# EAGLE design Energy Meter for Home Assistant V1.1 (EAGLE 6.1)
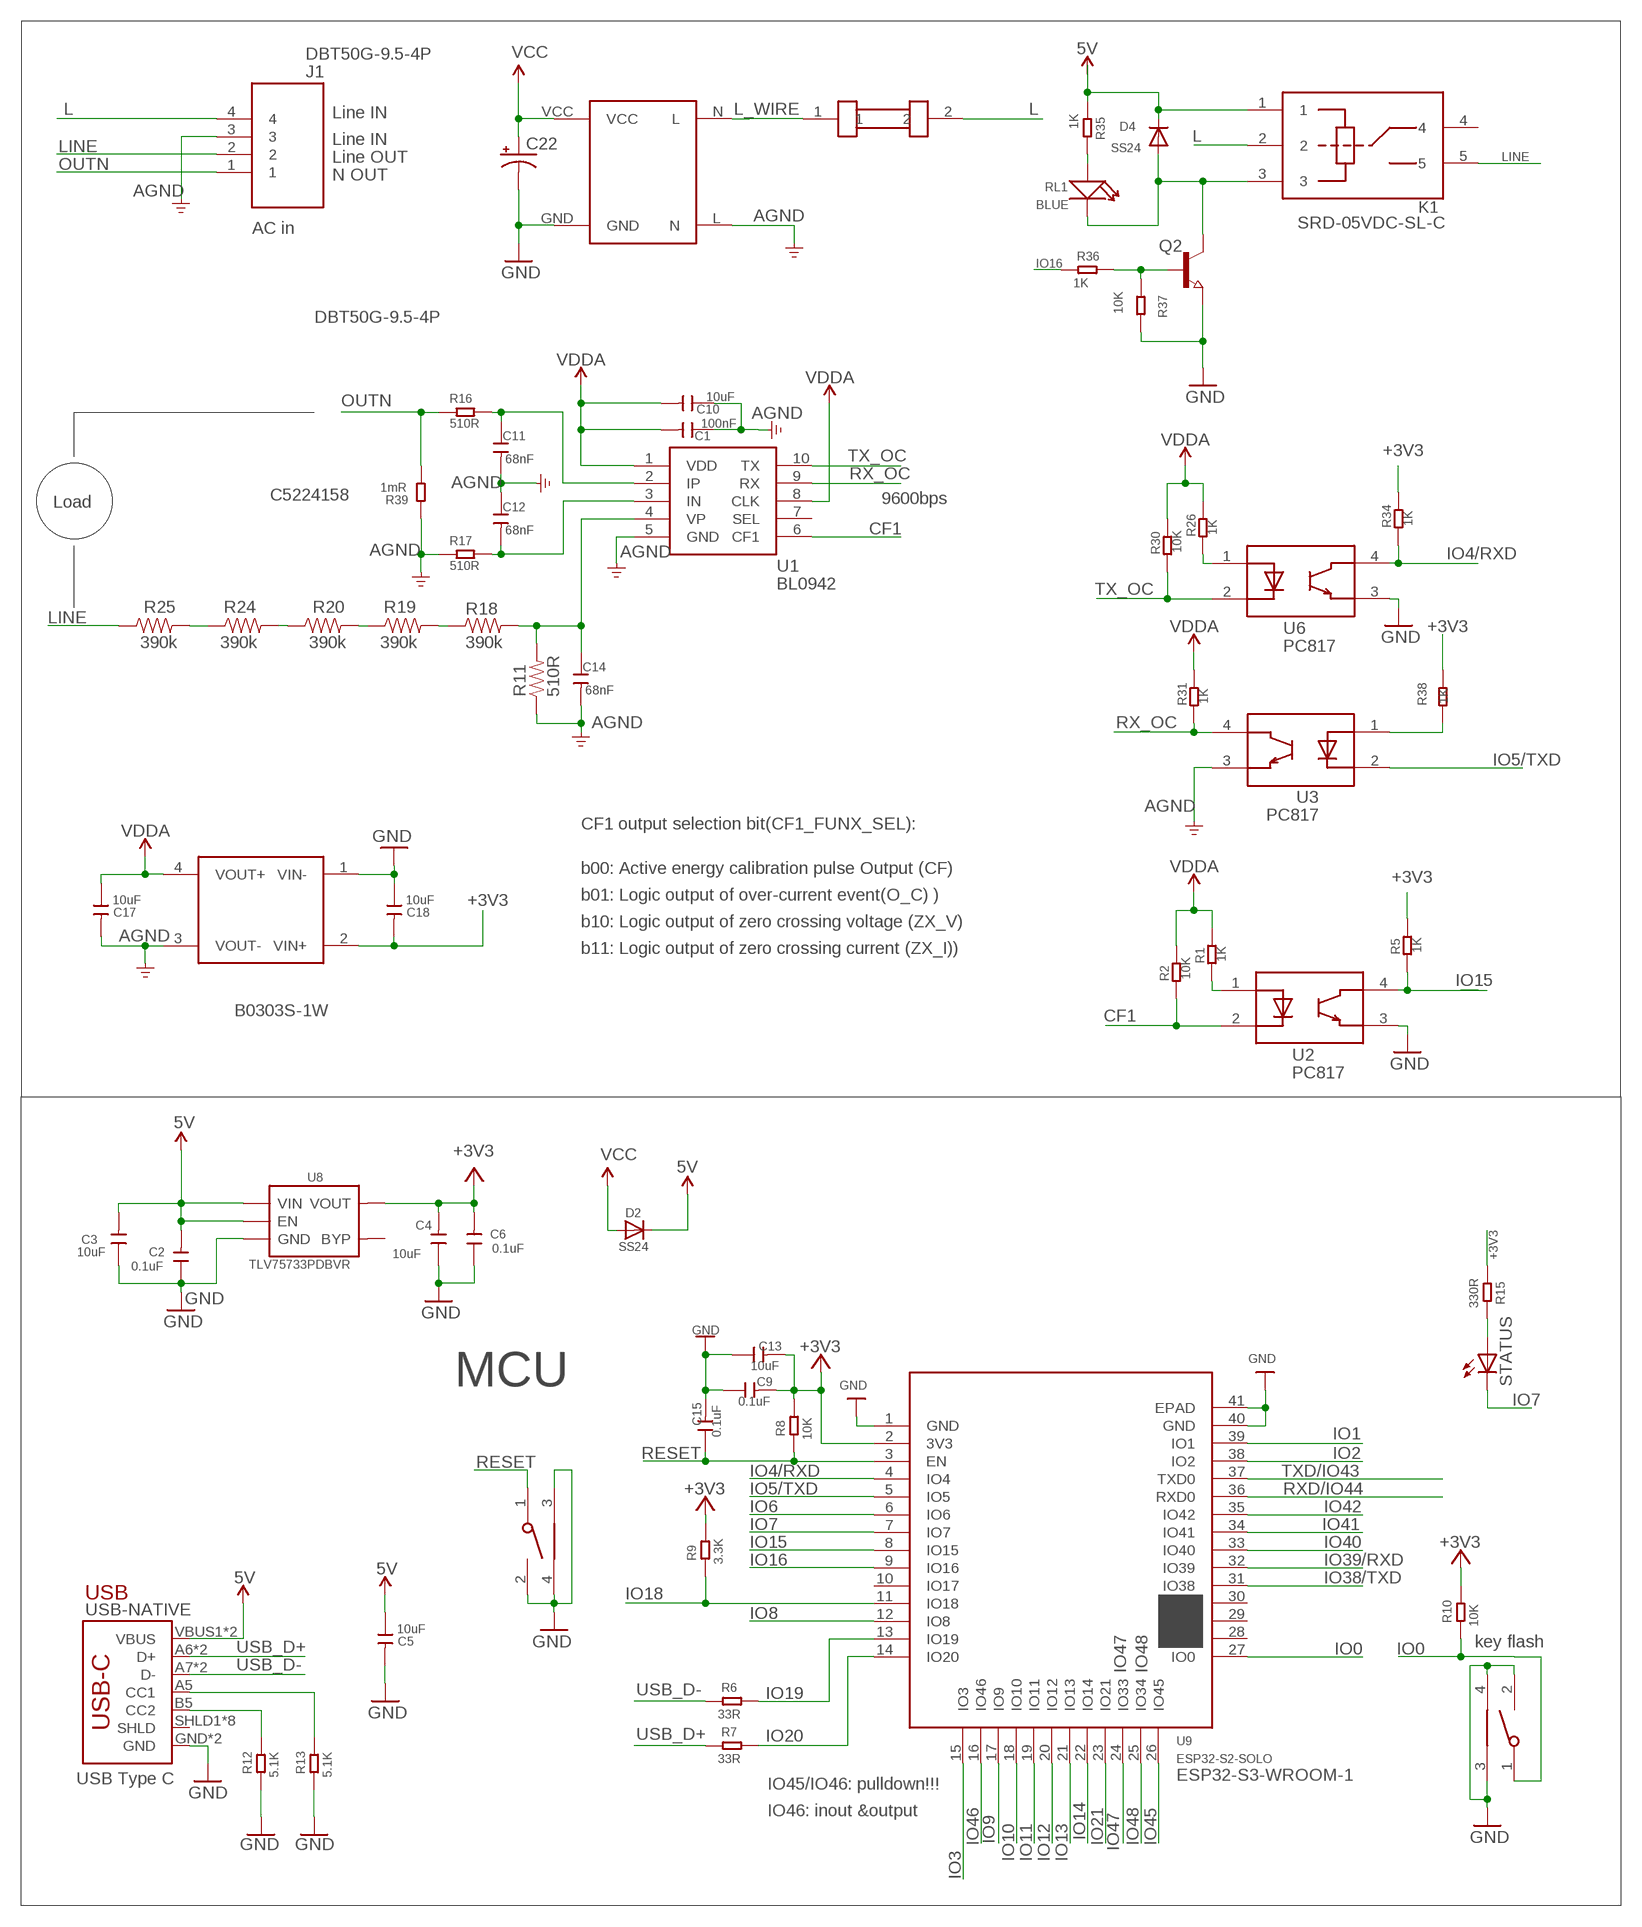
[diagram p0: schematic, sheet 1]

## Parts
BOOT  TS24CA  [2*4*3.5MM]
C1  100nF  C-0603  [0603]
C2  0.1uF  C-0603  [0603]
C3  10uF  C-0603  [0603]
C4  10uF  C-0603  [0603]
C5  10uF  C-0603  [0603]
C6  0.1uF  C-0603  [0603]
C9  0.1uF  C-0603  [0603]
C10  10uF  C-0603  [0603]
C11  68nF  C-0603  [0603]
C12  68nF  C-0603  [0603]
C13  10uF  C-0603  [0603]
C14  68nF  C-0603  [0603]
C15  0.1uF  C-0603  [0603]
C17  10uF  C-0603  [0603]
C18  10uF  C-0603  [0603]
C22  CAP_POL3528-KIT  [EIA3528-KIT]
D2  SS24  DIODESMA  [SMADIODE]
D4  SS24  DIODESMA  [SMADIODE]
F1  FUSE01  [FUSE01-D4XL11]
J1  DBT50G-9.5-4P  [DBT50G-9.5-4P]
K1  JQC3FF  [DIP5_JQC3FF]
Q2  NPN-TRANSISTOR_SOT23  [SOT23]
R1  1K  R-0603  [R0603]
R2  10K  R-0603  [R0603]
R5  1K  R-0603  [R0603]
R6  33R  R-0603  [R0603]
R7  33R  R-0603  [R0603]
R8  10K  R-0603  [R0603]
R9  3.3K  R-0603  [R0603]
R10  10K  R-0603  [R0603]
R11  510R  RESISTOR1206  [1206]
R12  5.1K  R-0603  [R0603]
R13  5.1K  R-0603  [R0603]
R15  330R  R-0603  [R0603]
R16  510R  R-0603  [R0603]
R17  510R  R-0603  [R0603]
R18  390k  RESISTOR1206  [1206]
R19  390k  RESISTOR1206  [1206]
R20  390k  RESISTOR1206  [1206]
R24  390k  RESISTOR1206  [1206]
R25  390k  RESISTOR1206  [1206]
R26  1K  R-0603  [R0603]
R30  10K  R-0603  [R0603]
R31  1K  R-0603  [R0603]
R34  1K  R-0603  [R0603]
R35  1K  R-0603  [R0603]
R36  1K  R-0603  [R0603]
R37  10K  R-0603  [R0603]
R38  1K  R-0603  [R0603]
R39  1mR  DISCRETE_R-2512  [DISCRETE_R2512]
RL1  BLUE  LED'0603'  [LED-0603]
RST  TS24CA  [2*4*3.5MM]
STATUS  LED5MM  [LED5MM]
U1  BL0942  BL0942*SOP*  [SOP8-100P-600L500W175H]
U2  PC817  [SMD4-254P-1016L460W]
U3  PC817  [SMD4-254P-1016L460W]
U5  AC-DCHLK01  [HLK-PM01]
U6  PC817  [SMD4-254P-1016L460W]
U7  B0303S  [B0303S]
U8  TLV75733PDBVR  SPX3819  [SOT23-5]
U9  ESP32­S2­SOLO  [ESP32-­S2-­SOLO]
USB-NATIVE  USB_C5  [USB-C-16P-5]

## Nets
5V: C2.2 C3.2 C5.1 D2.C D4.C K1.1 R35.1 U8.1(VIN) U8.3(EN) USB-NATIVE.VBUS1(VBUS) USB-NATIVE.VBUS2(VBUS)
+3V3: C4.2 C6.2 C9.2 C13.2 C18.2 R5.2 R8.2 R9.2 R10.2 R15.1 R34.2 R38.2 U7.2(VIN+) U8.5(VOUT) U9.2(3V3)
AGND: C1.1 C10.1 C11.2 C12.1 C14.2 C17.2 J1.3 R11.1 R17.2 R39.1 U1.5(GND) U3.3 U5.L(N) U7.3(VOUT-)
CF1: R2.1 U1.6(CF1) U2.2
GND: BOOT.2 BOOT.3 BOOT.4 C2.1 C3.1 C4.1 C5.2 C6.1 C9.1 C13.1 C15.2 C18.1 C22.C(-) Q2.2(E) R12.1 R13.1 R37.2 RST.2 RST.3 RST.4 U2.3 U5.GND U6.3 U7.1(VIN-) U8.2(GND) U9.1(GND) U9.40(GND) U9.41(EPAD) USB-NATIVE.GND USB-NATIVE.GND2(GND)
IO0: BOOT.1 R10.1 U9.27(IO0)
IO1: U9.39(IO1)
IO2: U9.38(IO2)
IO3: U9.15(IO3)
IO4/RXD: R34.1 U6.4 U9.4(IO4)
IO5/TXD: U3.2 U9.5(IO5)
IO6: U9.6(IO6)
IO7: STATUS.K(C) U9.7(IO7)
IO8: U9.12(IO8)
IO9: U9.17(IO9)
IO10: U9.18(IO10)
IO11: U9.19(IO11)
IO12: U9.20(IO12)
IO13: U9.21(IO13)
IO14: U9.22(IO14)
IO15: R5.1 U2.4 U9.8(IO15)
IO16: R36.1 U9.9(IO16)
IO18: R9.1 U9.11(IO18)
IO19: R6.2 U9.13(IO19)
IO20: R7.2 U9.14(IO20)
IO21: U9.23(IO21)
IO38/TXD: U9.31(IO38)
IO39/RXD: U9.32(IO39)
IO40: U9.33(IO40)
IO41: U9.34(IO41)
IO42: U9.35(IO42)
IO45: U9.26(IO45)
IO46: U9.16(IO46)
IO47: U9.24(IO33)
IO48: U9.25(IO34)
L: F1.2 J1.4 K1.2
L_WIRE: F1.1 U5.N(L)
LINE: J1.2 K1.5 R25.1
N$1: R1.1 U2.1
N$5: R15.2 STATUS.A
N$6: R13.2 USB-NATIVE.A5(CC1)
N$8: R38.1 U3.1
N$10: C11.1 R16.1 U1.2(IP)
N$11: C12.2 R17.1 U1.3(IN)
N$13: R26.1 U6.1
N$14: R12.2 USB-NATIVE.B5(CC2)
N$22: C14.1 R11.2 R18.2 U1.4(VP)
N$23: R20.1 R24.2
N$25: R24.1 R25.2
N$26: R35.2 RL1.+
N$27: D4.A K1.3 Q2.3(C) RL1.-
N$28: Q2.1(B) R36.2 R37.1
N$29: R19.1 R20.2
N$30: R18.1 R19.2
OUTN: J1.1 R16.2 R39.2
RESET: C15.1 R8.1 RST.1 U9.3(EN)
RX_OC: R31.1 U1.9(RX) U3.4
RXD/IO44: U9.36(RXD0)
TX_OC: R30.1 U1.10(TX) U6.2
TXD/IO43: U9.37(TXD0)
USB_D+: R7.1 USB-NATIVE.A6(D+) USB-NATIVE.B6(D+)
USB_D-: R6.1 USB-NATIVE.A7(D-) USB-NATIVE.B7(D-)
VCC: C22.A(+) D2.A U5.VCC
VDDA: C1.2 C10.2 C17.1 R1.2 R2.2 R26.2 R30.2 R31.2 U1.1(VDD) U1.8(CLK) U7.4(VOUT+)
Unconnected: K1.4 U1.7(SEL) U8.4(BYP) U9.10(IO17) U9.28(IO35) U9.29(IO36) U9.30(IO37) USB-NATIVE.SHLD1(SHLD) USB-NATIVE.SHLD2(SHLD) USB-NATIVE.SHLD3(SHLD) USB-NATIVE.SHLD4(SHLD) USB-NATIVE.SHLD5(SHLD) USB-NATIVE.SHLD6(SHLD) USB-NATIVE.SHLD7(SHLD) USB-NATIVE.SHLD8(SHLD)

## Notes on the sheet
- Line IN
- Line IN
- Line OUT
- N OUT
- SRD-05VDC-SL-C
- AC in
- DBT50G-9.5-4P
- C5224158 | 9600bps
- Load
- CF1 output selection bit(CF1_FUNX_SEL):
- b00: Active energy calibration pulse Output (CF)
- b01: Logic output of over-current event(O_C) )
- b10: Logic output of zero crossing voltage (ZX_V)
- b11: Logic output of zero crossing current (ZX_I))
- B0303S-1W
- MCU
- USB
- key flash
- IO47 | IO48
- USB Type C | ESP32-S3-WROOM-1
- IO45/IO46: pulldown!!!
- IO46: inout &output

## Library data of the parts
BOOT RST = sale:TS24CA
C1-C6 C9-C15 C17 C18 = Discrete:C*: Ceramic Capacitors
C22 = SparkFun-Capacitors:CAP_POL: Capacitor Polarized These are standard SMD and PTH capacitors. Normally 10uF, 47uF, and 100uF in electrolytic and tantalum varieties. Always verify the external diameter of the through hole cap, it varies with capacity, voltage, and manufacturer. The EIA devices should be standard.
D2 D4 = adafruit:DIODE: Diode SMADIODE - SMA Surface Mount Package 20V 1A Schottky Diode Digikey: 641-1014-6-ND DO-1N4148 - Through Hole Small Current Diode SOD-123 20V 1 A (.5mV Vf) Schottky Diode - Digikey: MBRX120TPMSCT-ND SOD-323 10V 570mA (.38mV Vf, 3ns) Schottky Diode - Digikey: ZLLS410CT-ND SOD-523 30V 30mA Schottky Diode (RB751S-40TE61) - Digikey: RB751S-40TE61CT-ND SOT23-R/W - SOT23 Package (R = Solder Paste/Reflow Ovens, W = Hand-Soldering) BAT54Film 40V 300mA - Digikey: 497-7162-1-ND
F1 = user:FUSE01
J1 = user:DBT50G-9.5-4P
K1 = 1mytest:JQC3FF
Q2 = semicon-smd-ipc:NPN-TRANSISTOR_: NPN TRANSISTOR
R1 R2 R5-R10 R12 R13 R15-R17 R26 R30 R31 R34-R38 = Discrete:R*
R11 R18-R20 R24 R25 = SparkFun-Resistors:RESISTOR: Resistor Basic schematic elements and footprints for 0603, 1206, and PTH resistors.; K: 45K
R39 = A9G:DISCRETE_R*
RL1 = Discrete:LED*
STATUS = led:LED: LED OSRAM: - CHIPLED LG R971, LG N971, LY N971, LG Q971, LY Q971, LO R971, LY R971 LH N974, LH R974 LS Q976, LO Q976, LY Q976 LO Q996 - Hyper CHIPLED LW Q18S LB Q993, LB Q99A, LB R99A - SideLED LS A670, LO A670, LY A670, LG A670, LP A670 LB A673, LV A673, LT A673, LW A673 LH A674 LY A675 LS A676, LA A676, LO A676, LY A676, LW A676 LS A679, LY A679, LG A679 - Hyper Micro SIDELED® LS Y876, LA Y876, LO Y876, LY Y876 LT Y87S - SmartLED LW L88C, LW L88S LB L89C, LB L89S, LG L890 LS L89K, LO L89K, LY L89K LS L896, LA L896, LO L896, LY L896 - TOPLED LS T670, LO T670, LY T670, LG T670, LP T670 LSG T670, LSP T670, LSY T670, LOP T670, LYG T670 LG T671, LOG T671, LSG T671 LB T673, LV T673, LT T673, LW T673 LH T674 LS T676, LA T676, LO T676, LY T676, LB T676, LH T676, LSB T676, LW T676 LB T67C, LV T67C, LT T67C, LS T67K, LO T67K, LY T67K, LW E67C LS E67B, LA E67B, LO E67B, LY E67B, LB E67C, LV E67C, LT E67C LW T67C LS T679, LY T679, LG T679 LS T770, LO T770, LY T770, LG T770, LP T770 LB T773, LV T773, LT T773, LW T773 LH T774 LS E675, LA E675, LY E675, LS T675 LS T776, LA T776, LO T776, LY T776, LB T776 LHGB T686 LT T68C, LB T68C - Hyper Mini TOPLED® LB M676 - Mini TOPLED Santana® LG M470 LS M47K, LO M47K, LY M47K Source: http://www.osram.convergy.de LUXEON: - LUMILED® LXK2-PW12-R00, LXK2-PW12-S00, LXK2-PW14-U00, LXK2-PW14-V00 LXK2-PM12-R00, LXK2-PM12-S00, LXK2-PM14-U00 LXK2-PE12-Q00, LXK2-PE12-R00, LXK2-PE12-S00, LXK2-PE14-T00, LXK2-PE14-U00 LXK2-PB12-K00, LXK2-PB12-L00, LXK2-PB12-M00, LXK2-PB14-N00, LXK2-PB14-P00, LXK2-PB14-Q00 LXK2-PR12-L00, LXK2-PR12-M00, LXK2-PR14-Q00, LXK2-PR14-R00 LXK2-PD12-Q00, LXK2-PD12-R00, LXK2-PD12-S00 LXK2-PH12-R00, LXK2-PH12-S00 LXK2-PL12-P00, LXK2-PL12-Q00, LXK2-PL12-R00 Source: www.luxeon.com KINGBRIGHT: KA-3528ASYC Source: www.kingbright.com
U1 = user:BL0942
U2 U3 U6 = self:PC817
U5 = Moja Knjižnica:AC-DCHLK01
U7 = user:B0303S
U8 = IC:SPX3819
U9 = self:ESP32­S2­SOLO
USB-NATIVE = USBC:USB_C: USB Type C 16Pin Connector Super Speed pins not available on the 16-pin purely SMD connector so this part is best for USB 2.0 implementations. D1 and D2 are tied together enabling D+/- no matter which way the cable is plugged into the connector. The two channel configuration pins (CC1/2) are exposed. These are normally connected to ground via 5.1k resistors but can be reconfigured for high current/high power applications.

## Net classes
0 default: width 0.203 mm, drill 0.305 mm, clearance 0.152 mm
1 AC High Current: width 2.54 mm, drill 25.4 mm, clearance 1.27 mm
2 gnd: width 0.305 mm, drill 0.559 mm, clearance 0.254 mm
3 usbvcc: width 0.508 mm, drill 0.61 mm, clearance 0.254 mm

## Board
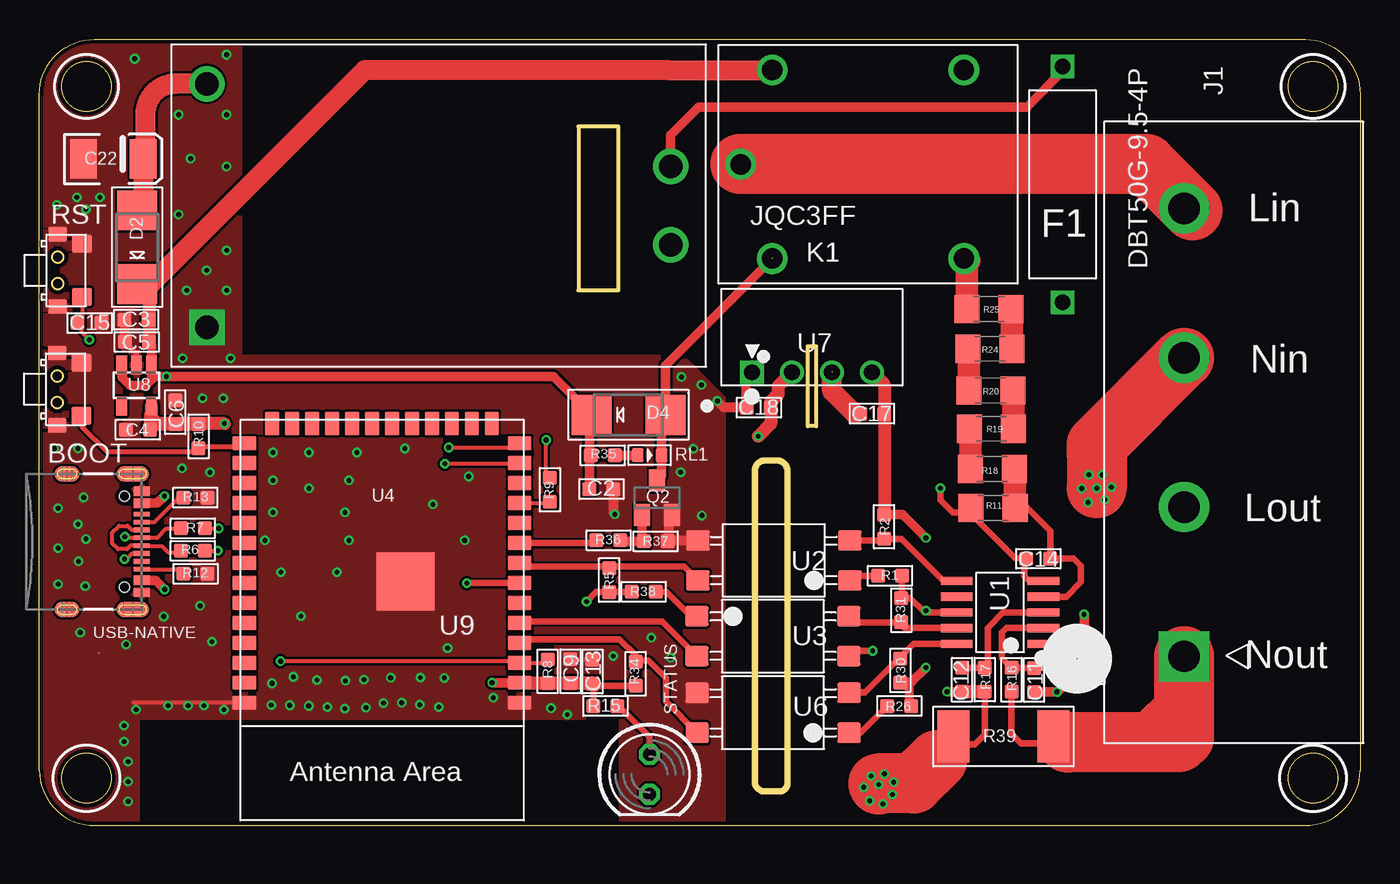
[diagram p1: board, top side]
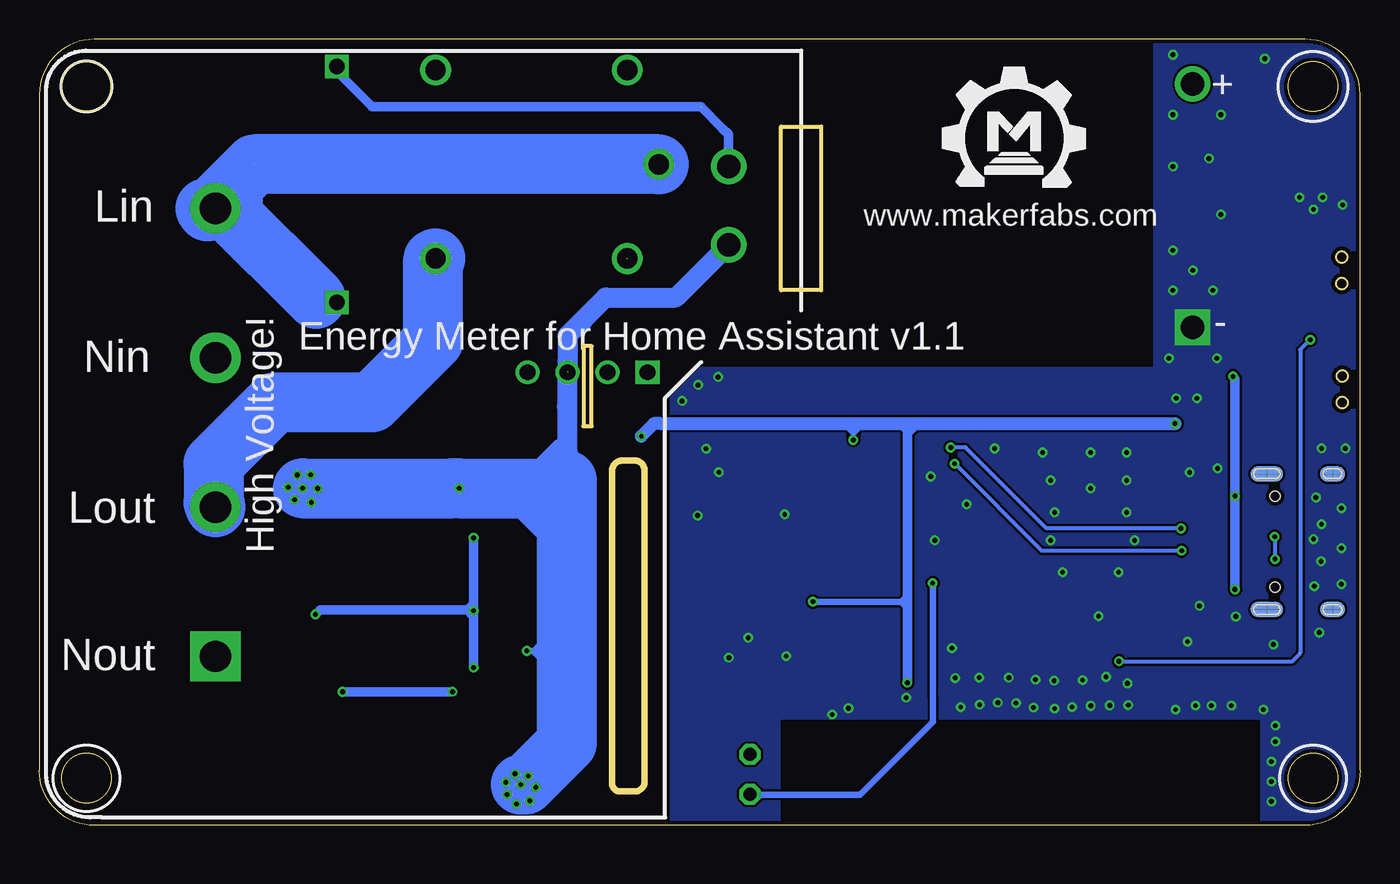
[diagram p2: board, bottom side, seen from below]

Size 84 x 50 mm. Coordinates in mm from the lower left corner, seen from the top.
Outline: 0,3.5 0,46.5 arc-90 3.5,50 80.5,50 arc-90 84,46.5 84,3.5 arc-90 80.5,0 3.5,0 arc-90 0,3.5
Outline: 45.52,22.57 45.52,2.75 arc90 46.11,2.16 47.07,2.16 arc90 47.57,2.66 47.57,22.53 arc90 46.89,23.22 46.16,23.22 arc90 45.52,22.57
Outline: 34.29,44.45 34.29,34.04 36.83,34.04 36.83,44.45 34.29,44.45
Outline: 48.87,30.48 49.4,30.48 49.4,25.4 48.87,25.4 48.87,30.48
Outline: circle at 81,3 radius 1.57
Outline: circle at 81,47 radius 1.57
Outline: circle at 3,3 radius 1.57
Outline: circle at 3,47 radius 1.57
Copper layers (1*16): Top 0.035mm / dielectric 1.5mm / Bottom 0.035mm
Design rules: minimum track width 6mil, minimum drill 12mil, track to track 6mil, track to pad 6mil, pad to pad 6mil, via to via 6mil, smd to smd 0mil, copper to edge 10mil, drill to drill 10mil, minimum pad ring 10mil, minimum via ring 6mil, stop-mask expansion 2mil, vias tented up to drill 100mil, thermal gap 0mil
tRestrict: area 6.4,0 to 36.8,6.7
bRestrict: area 6.4,0 to 36.8,6.7

### Footprints (pad centres in the part's own frame; a part is rotated, then mirrored left to right if it is on the bottom)
2*4*3.5MM = smd 1.15 x 1.3: 1 -1.675,0; 2 1.675,0 | smd 0.9 x 1.2: 3 2.3,1.55; 4 -2.3,1.55
0603 = smd 0.889 x 0.889: 1 -0.762,0; 2 0.762,0
EIA3528-KIT = smd 1.7 x 2.5: A 1.9,0; C -1.9,0
SMADIODE = smd 2.54 x 2.54: A 2.349,0; C -2.349,0
FUSE01-D4XL11 = drill 1 square: 1 -7.5,0; 2 7.5,0
DBT50G-9.5-4P = drill 2 pad 3.2 square: 1 -14.25,0 | drill 2 pad 3.2: 2 -4.75,0; 3 4.75,0; 4 14.25,0
DIP5_JQC3FF = drill 1.3: 1 0,12; 2 -2,6; 3 0,0; 4 12.2,12; 5 12.2,0
SOT23 = smd 1 x 1.4: 1 -0.95,-1.1; 2 0.95,-1.1; 3 0,1.1
R0603 = smd 0.889 x 0.889: 1 -0.762,0; 2 0.762,0
1206 = smd 1.6 x 1.8: 1 -1.4,0; 2 1.4,0
DISCRETE_R2512 = smd 2.032 x 3.302: 1 -3.175,0; 2 3.175,0
LED-0603 = smd 0.762 x 0.889: + -0.762,0; - 0.762,0
LED5MM = drill 0.813 octagon: A -1.27,0; K 1.27,0
SOP8-100P-600L500W175H = smd 0.525 x 2.014: 1 -2,-2.757; 2 -1,-2.757; 3 0,-2.757; 4 1,-2.757; 5 2,-2.757; 6 2,2.757; 7 1,2.757; 8 0,2.757; 9 -1,2.757; 10 -2,2.757
SMD4-254P-1016L460W = smd 1.5 x 1.3: 1 -4.83,1.27; 2 -4.83,-1.27; 3 4.83,-1.27; 4 4.83,1.27
HLK-PM01 = drill 1.5 square: GND 14.75,7.75 | drill 1.5: L -14.75,2.5; N -14.75,-2.5; VCC 14.75,-7.75
B0303S = drill 1 square: 1 -3.81,0 | drill 1: 2 -1.27,0; 3 1.27,0; 4 3.81,0
SOT23-5 = smd 0.69 x 1.2: 1 -0.95,-1.3; 2 0,-1.3; 3 0.95,-1.3; 4 0.95,1.3; 5 -0.95,1.3
ESP32-­S2-­SOLO = smd 1.5 x 0.9: 1 -8.75,5.26; 2 -8.75,3.99; 3 -8.75,2.72; 4 -8.75,1.45; 5 -8.75,0.18; 6 -8.75,-1.09; 7 -8.75,-2.36; 8 -8.75,-3.63; 9 -8.75,-4.9; 10 -8.75,-6.17; 11 -8.75,-7.44; 12 -8.75,-8.71; 13 -8.75,-9.98; 14 -8.75,-11.25; 27 8.75,-11.25; 28 8.75,-9.98; 29 8.75,-8.71; 30 8.75,-7.44; 31 8.75,-6.17; 32 8.75,-4.9; 33 8.75,-3.63; 34 8.75,-2.36; 35 8.75,-1.09; 36 8.75,0.18; 37 8.75,1.45; 38 8.75,2.72; 39 8.75,3.99; 40 8.75,5.26 | smd 0.9 x 1.5: 15 -6.985,-12.5; 16 -5.715,-12.5; 17 -4.445,-12.5; 18 -3.175,-12.5; 19 -1.905,-12.5; 20 -0.635,-12.5; 21 0.635,-12.5; 22 1.905,-12.5; 23 3.175,-12.5; 24 4.445,-12.5; 25 5.715,-12.5; 26 6.985,-12.5 | smd 3.7 x 3.7: 41 -1.5,-2.46
USB-C-16P-5 = smd 0.3 x 1: A5 -1.25,-0.34; A6 -0.25,-0.34; A7 0.25,-0.34; A8 1.25,-0.34; B5 1.75,-0.34; B6 0.75,-0.34; B7 -0.75,-0.34; B8 -1.75,-0.34 | smd 0.6 x 1: GND -3.225,-0.34; GND2 3.225,-0.34; VBUS1 -2.45,-0.34; VBUS2 2.45,-0.34 | smd 1 x 2.1: SHLD1 -4.32,-0.915; SHLD2 4.32,-0.915 | smd 1 x 2.1 bottom: SHLD3 -4.32,-0.915; SHLD4 4.32,-0.915 | smd 1 x 1.6: SHLD5 -4.32,-5.095; SHLD8 4.32,-5.095 | smd 1 x 1.6 bottom: SHLD6 -4.32,-5.095; SHLD7 4.32,-5.095 | hole 0.65: -2.89,-1.445; 2.89,-1.445

### Placement (x,y rotation side)
BOOT  2.68,27.74 90 top
C1  67.08,10.37 90 top
C2  35.74,21.39 180 top
C3  6.16,32.16 0 top
C4  6.27,25.18 0 top
C5  6.19,30.74 180 top
C6  8.65,26.29 270 top
C9  33.77,9.8 270 top
C10  65.63,10.36 90 top
C11  63.26,9.25 270 top
C12  58.68,9.26 90 top
C13  35.18,9.79 270 top
C14  63.53,16.96 180 top
C15  3.2,31.96 0 top
C17  52.95,26.18 180 top
C18  45.76,26.57 0 top
C22  4.71,42.4 0 top
D2  6.23,36.77 90 top
D4  37.46,26.11 0 top
F1  65.07,40.77 270 top
J1  72.8,25 90 top
K1  46.6,36.05 0 top
Q2  39.28,20.84 0 top
R1  54.11,15.87 0 top
R2  53.73,19 90 top
R5  36.23,15.6 270 top
R6  9.76,17.47 0 top
R7  9.77,18.89 0 top
R8  32.32,9.8 270 top
R9  32.47,21.35 90 top
R10  10.12,24.74 90 top
R11  60.65,20.19 0 top
R12  9.94,16 180 top
R13  9.92,20.85 180 top
R15  36,7.59 0 top
R16  61.82,9.26 270 top
R17  60.12,9.27 270 top
R18  60.6,22.67 0 top
R19  60.54,25.23 180 top
R20  60.51,27.66 0 top
R24  60.46,30.31 180 top
R25  60.4,32.84 0 top
R26  54.68,7.6 0 top
R30  54.76,9.86 270 top
R31  54.82,13.68 90 top
R34  37.92,9.65 270 top
R35  35.83,23.53 0 top
R36  36.2,18.13 0 top
R37  39.19,18.07 0 top
R38  38.44,14.85 180 top
R39  61.3,5.65 0 top
RL1  38.82,23.54 0 top
RST  2.71,35.3 90 top
STATUS  38.8,3.24 270 top
U1  61.09,13.55 90 top
U2  46.71,16.85 180 top
U3  46.65,12.03 0 top
U5  25.4,39.42 180 top
U6  46.66,7.16 180 top
U7  49.14,28.81 0 top
U8  6.18,27.98 180 top
U9  21.8,13.06 180 top
U$1  [MAKERFABS_0.3]  26.12,40.63 0 bottom
USB-NATIVE  6.85,18.04 270 top

### Tracks (layer width: path | path; a pad name or v marks a point on that pad's centre or on a via)
5V  (via drill 0.3)
  Top 0.254: 6.97,30.73 6.97,30.74 arc90 6.96,30.76 C5.1 arc-90 C5.1
  Top 0.406: D4.C 34.53,26.7 34.47,26.7 34.47,26.67 34.47,26.75 34.47,26.44 34.42,26.49 34.42,26.67 34.39,26.67 34.37,26.7 34.42,26.7 34.49,26.62 34.48,26.64
  Top 0.61: USB-NATIVE.VBUS2 7.39,15.59 v7.97,15.01 | v7.96,20.95 7.51,20.49 6.45,20.49 | 6.45,20.49 | 6.45,20.49 USB-NATIVE.VBUS1 | 6.97,30.73 7.14,30.56 7.14,29.11 | 7.14,29.11 7.14,28.76 | 7.14,28.76 7.14,28.37 6.76,27.99 5.77,27.99 5.27,28.49 5.27,29.24 U8.3 | 7.14,29.11 U8.1 | C5.1 6.96,32.13 C3.2 | 7.14,28.76 7.35,28.55 v8.08,28.55 30.48,28.55 32.7,28.55 35.06,26.19 35.06,26.16 D4.C 35.02,26.21 34.96,26.21 34.98,26.19 C2.2 34.98,23.54 R35.1
  Top 0.813: D2.C 6.65,33.99 6.97,33.67 6.97,30.73
  Top 1.27: 6.65,33.99 20.7,48.04 39.96,48.04 K1.1 arc-90 46.61,48.03 K1.1 arc90 K1.1 | 6.65,33.99 6.56,33.91 6.65,33.99
  Bottom 0.61: v7.97,15.01 v7.97,20.94 v7.96,20.95 7.96,28.43 v8.08,28.55
+3V3  (via drill 0.3)
  Top 0.254: R9.2 32.23,22.36 v32.23,24.51
  Top 0.406: R38.2 36.25,14.86 R5.2 35.41,14.84 v34.8,14.22 | R34.2 34.88,8.88 34.69,9.07 | 35.12,9.07 35.13,9.07 | 35.13,9.07 C13.2 35.24,8.97 R15.1 | 35.13,9.07 35.12,9.07 | 35.12,9.07 32.36,9.07 R8.2 | C6.2 8.62,25.5 7.62,25.5 | 7.11,26.42 6.86,26.16 6.86,25.15 7,25.15 C4.2
  Top 0.61: 35.12,9.07 v28.8,9.07
  Top 0.813: 35.21,9.02 35.21,9.01 35.19,9.01 35.12,9.07 34.69,9.07 U9.2 30.58,9.04 C9.2 | v11.77,25.55 7.52,25.55 | 7.52,25.55 7.14,25.94 U8.5 | R10.2 7.62,25.5 7.58,25.5 | 7.58,25.5 7.52,25.55 | 7.58,25.5 7.36,25.5 C4.2 | U7.2 46.99,27.93 46.99,27.43 46.52,26.96 C18.2 46.52,25.55 v45.72,24.75
  Bottom 0.254: 32.44,25.55 32.23,25.55 v32.23,24.51 32.23,24.86 32.23,24.87 | 31.65,25.45 32.23,24.87 | 32.23,24.87 32.69,25.32
  Bottom 0.406: v34.8,14.22 29.21,14.22 | 29.21,14.22 28.7,14.22 28.7,14.38 28.8,14.48 | 28.7,14.73 29.21,14.22 | 29.21,14.22 28.7,13.72 | 29.21,25.4 28.7,24.89 28.19,25.4 28.45,25.65 28.35,25.55 28.32,25.55
  Bottom 0.61: v28.8,9.07 28.8,14.48 28.8,25.52 28.68,25.64 28.4,25.64 28.32,25.55
  Bottom 0.813: v11.77,25.55 28.32,25.55 32.44,25.55 44.45,25.55 44.91,25.55 v45.72,24.75
AGND  (via drill 0.3)  (1 unrouted)
  Top 0.254: U7.3 U7.3 arc90 50.39,28.83 50.39,28.85 50.39,27.71 arc90 51.92,26.19 51.92,26.26 50.32,27.86 | v57.3,21.44 57.3,21.46 arc-90 57.33,21.49
  Top 0.406: U1.5 62.95,15.55 62.66,15.84 62.66,16.88 62.6,16.94 62.6,17.02 | R17.2 60.12,5.79 59.5,5.16 58.62,5.16 58.56,5.22 58.14,5.64 58.14,5.76 58.22,5.68 58.24,5.68 58.16,5.61 58.14,5.61 58.13,5.62 R39.1 | U3.3 51.82,11.1 v53,11.1 | v57.3,21.44 57.3,20.7 58.09,19.92 58.98,19.92 R11.1 59.56,19.88 59.56,19.48 62.03,17.02 62.6,17.02 | v66.7,20.54 66.29,20.95 v66.29,21.42 66.31,21.44 v67.25,21.44 67.31,21.39 67.31,21.34 | 67.31,21.34 67.49,21.51 | 67.49,21.51 v68.19,21.51 | 67.49,21.51 67.6,21.62 v67.6,22.29 67.58,22.31 v66.75,22.31 | 67.31,21.34 67.77,20.88 v67.77,20.71 | v52.42,2.42 52.9,2.9 v52.9,3.14 53.04,3.27 v53.74,3.27 54.27,2.74 v54.34,2.74 54.25,2.65 v54.25,1.96 | v54.25,1.96 53.89,2.31 | v54.25,1.96 v53.66,1.36 53.45,1.56 v52.8,1.56 | C14.2 62.71,17.02 62.6,17.02
  Top 0.61: 64.77,8.49 C11.2 v64.72,8.49 64.77,8.49 65.63,9.36 C10.1 C1.1 | v57.72,8.5 C12.1 arc90 C12.1
  Top 0.813: C17.2 51.86,26.18 | R17.2 C12.1 | 53.89,2.31 53.61,2.59 v53.38,2.59
  Top 1.27: 51.86,26.18 50.41,27.62 U7.3 | 58.13,5.62 58.13,5.2 57.1,4.17
  Top 3.81: v67.25,21.44 67.25,23.63 67.25,24.2 J1.3 | 57.1,4.17 55.6,2.67 53.34,2.67 53.38,2.63 v53.38,2.59
  Bottom 0.254: 50.41,26.66 50.45,26.62 | 52.17,11.58 52.68,11.07 | 52.68,11.07 52.12,10.52 | v53,11.1 52.98,11.07 52.68,11.07
  Bottom 0.406: v53,11.1 50.52,11.1 arc90 50.45,11.03 | v57.3,21.44 57.73,21.44
  Bottom 0.61: v64.72,8.49 v57.72,8.49 arc-90 v57.72,8.5
  Bottom 1.27: 50.42,29.51 50.42,28.76 50.4,28.78 50.4,28.85 50.4,28.84 U7.3 | 50.41,26.66 U7.3 50.42,28.82 50.42,28.88 50.42,31.14 49.45,32.11 47.98,33.58 43.51,33.58 40.11,36.98 40.11,37.01 40.15,36.96 U5.L | 53.31,21.44 53.31,21.46 50.72,24.06 50.4,23.74 50.4,21.97 50.43,21.97 50.45,21.95 | 53.31,21.44 50.49,18.61 | 50.45,26.62 50.45,22.3 51.13,22.3 51.13,21.78 50.61,21.78 | 49.99,16.87 50.04,16.87 54.51,21.34 54.36,21.49 53.37,21.49 53.31,21.44 | 53.31,21.44 53.31,21.39 | 53.31,21.44
  Bottom 2.54: 57.73,21.44 v57.3,21.44 | 50.95,21.44 50.61,21.78 50.45,21.95
  Bottom 3.81: 50.45,21.95 50.45,11.03 50.45,5.24 53.1,2.59 v53.38,2.59 | v67.25,21.44 57.73,21.44 | v57.3,21.44 50.95,21.44
CF1
  Top 0.406: U1.6 57.5,15.55 54.81,18.23 R2.1 53.62,18.12 U2.2
GND  (via drill 0.3)
  Top 0.254: C9.1 35.1,10.56 35.1,10.54 35.27,10.54 | U9.40 6,7.8
  Top 0.305: U8.2 6.18,29.99 C5.2
  Top 0.61: C5.2 5.43,32.13 C3.1 | U2.3 40.18,18.12 40.05,18 | 40.05,18 40.05,18.18 | 40.05,18.18 40.05,19.5 40.25,19.69 40.25,19.72 | 40.25,19.72 Q2.2 | 40.25,19.72 40.25,19.49 40.18,19.42 | R37.2 40.05,18.18 | 40.05,18 40.05,19.57 40.09,19.6 | C2.1 36.5,19.89 36.6,19.79 v36.6,19.79 v36.6,19.78 | U7.1 44.93,28.42 44.93,26.62 43.51,26.62 v43.13,27 v43.12,27 | C18.1 43.55,26.57 v43.12,27 | v43.12,27
  other vias: 2.6,12.27 2.96,39.18 10.38,27.17 11.7,27.17 10.85,22.46 41.6,23.95 42.13,19.7 40.78,22.47 36.5,10.76 38.91,11.93 40.15,10.66 14.75,7.65 15.93,7.64 17.14,7.6 18.31,7.52 19.43,7.43 20.78,7.49 21.89,7.77 23.05,7.8 24.2,7.67 25.41,7.52 28.87,8.12 25.96,11.28 25.76,9.38 24.23,9.4 14.8,9.03 16.16,9.45 17.65,9.24 19.47,9.2 20.65,9.27 22.35,9.39 32.54,7.45 33.57,7.04 11.91,36.57 9.37,34.03 11.91,34.03 10.64,35.3 11.91,41.9 8.86,38.86 8.86,45.21 9.62,42.41 11.91,45.21 6.06,48.76 11.91,49.02 2.38,39.95 1.11,39.47 3.86,39.95 12.16,29.71 9.11,29.71 9.07,22.71 0.94,23.98 2.46,23.98 1.19,20.17 2.82,20.86 1.19,15.34 2.92,15.22 1.19,17.63 2.97,18.21 2.49,16.79 2.46,19.15 5.52,11.51 7.91,13.28 10.22,13.97 10.98,11.68 10.47,7.62 8.19,7.62 5.39,6.35 5.65,4.06 5.65,1.52 5.65,2.79 5.39,5.33 6.16,7.36 9.46,7.62 11.74,7.36 15.37,16.1 18.92,16.1 14.35,18.13 19.69,18.13 16.64,13.3 27.31,22.19 27.05,18.13 25.02,20.42 14.86,23.72 14.86,19.91 19.43,19.91 23.24,23.97 17.15,23.72 20.19,23.72 19.69,21.94 17.15,21.43 14.86,21.94 40.84,28.52 42.11,28.02
  pour Top: -1.27,-1.52 43.43,-1.52 43.43,27.18 40.89,29.72 -1.27,29.72
  pour Top: 12.7,28.45 12.7,50.55 -2.54,50.55 -2.54,28.45
  pour Bottom: -1.27,-1.27 43.69,-1.27 43.69,27.18 41.91,28.96 12.95,28.96 12.95,49.78 -1.27,49.78
IO0
  Top 0.305: U9.27 12.8,24.06 10.11,24.06 9.8,23.75 4.3,23.75 2.74,25.31 2.74,25.92 2.75,25.93 2.75,26.08 2.74,26.07 BOOT.1
  Top 0.406: 10.16,24.13 10.16,24.01 R10.1 10.12,24.05 10.11,24.06
IO4/RXD
  Top 0.406: U9.4 30.78,11.84 36.91,11.84 37.92,10.83 R34.1 37.96,10.44 37.96,10.49 38.73,10.49 39.84,9.38 39.84,7.89 U6.4
IO5/TXD
  Top 0.406: U3.2 39.6,12.99 30.56,12.99 | 30.56,12.99 30.53,12.99 | U9.5 30.56,12.9 30.56,12.99
IO7  (via drill 0.3)
  Top 0.406: v27.18,15.41 30.64,15.41 30.56,15.41 U9.7
  Bottom 0.406: v27.18,15.41 27.17,15.4 27.17,8.11 27.17,6.59 31.83,1.93 38.76,1.93 STATUS.K
IO15
  Top 0.406: U2.4 40.99,16.48 36.26,16.48 | 36.26,16.48 36.09,16.48 | U9.8 30.76,16.48 31.07,16.48 36.12,16.48 arc-90 R5.1 36.23,16.46 arc-90 36.26,16.48
IO16
  Top 0.406: U9.9 35.27,17.96 R36.1
IO18
  Top 0.254: U9.11 32.43,20.51 32.48,20.55 R9.1
IO19  (via drill 0.3)
  Top 0.254: R6.2 v11.35,17.47 | v25.79,23 30.51,23 U9.13
  Bottom 0.254: v11.35,17.47 20.25,17.47 v25.79,23
IO20  (via drill 0.3)
  Top 0.254: R7.2 v11.4,18.89 | v26.04,24.04 30.29,24.04 30.55,24.3 U9.14
  Bottom 0.254: v11.4,18.89 19.95,18.89 25.1,24.04 v26.04,24.04
L  (1 unrouted)
  Top 3.81: 44.58,42.06 70.31,42.06 70.41,42.06 73.36,39.12
  Bottom 0.254: 65.3,33.38 65.19,33.27 F1.2 | 73.43,39.24 71.78,40.89 70.05,40.89 69.98,40.82 69.88,40.82 69.93,40.77 69.93,38.91 71.59,40.58 71.79,40.58
  Bottom 0.406: 73.43,39.24 72.85,39.24 72.82,39.27 J1.4
  Bottom 0.61: 65.33,33.38 65.3,33.38 65.3,33.3 65.51,33.5 66.4,33.5
  Bottom 3.81: 73.43,39.24 72.14,39.24 66.4,33.5 | K1.2 70.32,42.05 71.79,40.58 73.3,39.06
L_WIRE  (1 unrouted)
  Top 0.61: U5.N 40.15,41.8 40.13,41.78 40.13,43.92 41.91,45.7 62.79,45.7 65.08,47.98 F1.1
  Bottom 0.254: 41.94,45.72 40.54,44.32
  Bottom 0.61: 40.18,41.76 40.18,43.97 40.54,44.32 41.94,45.72 62.84,45.72 65.05,47.93 65.05,48.36
LINE
  Top 1.422: 59.13,35.95 59.14,35.94 59.13,35.95 59.13,35.96 59.01,36.07 58.94,36.07 58.96,36.05 K1.5 58.89,36.05 58.98,35.97 58.98,32.85 R25.1
  Bottom 3.81: K1.5 58.84,36.02 58.95,36.02 58.95,30.81 62.87,26.9 69.04,26.9 72.92,23.01 72.92,20.55 72.85,20.47 72.85,20.3 J1.2
N$1
  Top 0.406: R1.1 51.83,15.87 U2.1
N$5
  Top 0.406: STATUS.A 38.8,5.62 36.85,7.57 36.79,7.57 R15.2
N$6
  Top 0.254: USB-NATIVE.A5 7.33,19.29 8.89,20.85 8.9,20.84
  Top 0.406: R13.2 8.89,20.85
N$8
  Top 0.406: U3.1 41.43,13.3 39.9,14.84 39.21,14.84 R38.1
N$10
  Top 0.406: U1.2 61.51,12.55 61.22,12.26 61.22,10.62 R16.1 C11.1 arc-90 C11.1
N$11
  Top 0.406: U1.3 61.29,13.55 60.31,12.57 60.31,10.08 60.17,10.08 R17.1 58.69,10.03 C12.2 arc90 58.69,10.04 58.69,10.09 arc90 58.66,10.13 58.6,10.13 arc90 58.65,10.08
N$13
  Top 0.406: 51.6,5.82 51.43,5.99 51.43,5.89 51.45,5.87 51.47,5.87 U6.1 52.22,5.89 R26.1
N$14
  Top 0.254: USB-NATIVE.B5 8.62,16.29 8.75,16.29 arc-90 9.04,16 arc-90 9.03,15.99 8.92,15.99 R12.2
N$22
  Top 0.254: C14.1 C14.1 arc90 64.3,16.97
  Top 0.406: 64.3,16.97 C14.1 | U1.4 65.3,14.55 66.25,15.49 66.25,16.49 65.76,16.97 64.3,16.97 64.3,18.72 62.83,20.19 R11.2
  Top 1.422: R18.2 62.05,22.62 R11.2
N$23
  Top 1.422: R24.2 59.11,30.26 R20.1
N$25
  Top 1.422: R25.2 61.86,32.78 R24.1
N$26
  Top 0.61: R35.2 37.89,23.54 arc90 37.95,23.6 arc90 38,23.55 RL1.+
N$27  (1 unrouted)
  Top 0.61: Q2.3 39.58,22.23 RL1.- 39.58,26.11 D4.A 39.81,29.24 46.66,36.09
N$28
  Top 0.61: Q2.1 38.34,18.17 arc90 R37.1 37.01,18.07 arc-90 R36.2
N$29
  Top 1.422: R20.2 61.95,27.62 R19.1
N$30
  Top 1.422: R19.2 59.2,25.17 R18.1
OUTN
  Top 0.406: R16.2 61.82,5.83 62.44,5.21 64.04,5.21 R39.2
  Top 1.27: 65.38,5.26 64.87,5.26 R39.2 | 71.75,8.08 71.75,8.05 70.28,6.58 71.12,6.58 72.43,5.27 | 72.43,5.27 72.47,5.23 | 72.49,5.28 72.44,5.28 72.43,5.27
  Top 3.81: J1.1 72.8,5.59 72.49,5.28 65.41,5.28 65.38,5.26
RESET  (via drill 0.3)  (1 unrouted)
  Top 0.254: R8.1 arc-90 32.11,10.34 U9.3 30.45,10.44 v15.34,10.44 | RST.1 2.71,31.85 2.67,31.8 | 2.67,31.8 2.67,31.39 v3.17,30.89 | 2.67,31.8 2.51,31.96 C15.1
  Bottom 0.254: v3.17,30.89 3.81,30.25 3.81,10.97 | v15.34,10.44 4.32,10.44 3.81,10.95
RX_OC
  Top 0.406: U3.4 51.87,12.92 R31.1 arc90 55.19,12.55 U1.9
TX_OC
  Top 0.406: U1.10 55.59,11.55 | 55.59,11.55 52.49,8.45 51.51,8.45 U6.2 | 55.59,11.55 54.76,10.71 R30.1
USB_D+  (via drill 0.3)
  Top 0.254: USB-NATIVE.B6 5.91,17.29 5.79,17.17 | R7.1 8.08,18.88 7.49,18.29 7.47,18.29 USB-NATIVE.A6 5.51,18.29 v5.44,18.36 | USB-NATIVE.B6 5.91,17.29 | USB-NATIVE.B6 5.91,17.29 | 5.91,17.29 5.56,16.94 v5.41,16.94
  Bottom 0.254: v5.44,18.36 5.44,16.99 5.38,16.94 v5.41,16.94
USB_D-
  Top 0.254: R6.1 8.89,17.36 8.19,17.36 7.78,17.77 6.54,17.77 USB-NATIVE.A7 5.8,17.79 5.59,17.58 5,17.58 4.65,17.93 4.65,18.62 5.08,19.05 5.61,19.05 5.87,18.8 USB-NATIVE.B7
VCC
  Top 1.27: U5.VCC 8.66,47.17 arc90 6.74,45.25 6.74,42.68 arc-90 C22.A 6.61,39.5 arc-90 D2.A
VDDA  (via drill 0.3)
  Top 0.254: 56.35,13.65 56.29,13.59 56.25,13.59
  Top 0.406: U1.8 56.3,13.55 56.25,13.59 55.36,14.48 54.86,14.48 R31.2 54.87,14.49 R1.2 | R26.2 55.45,7.62 | 55.45,7.62 arc90 55.24,7.82 55.24,8.61 arc90 R30.2 | C17.1 53.7,26.2 53.7,27.99 53.7,28 53.73,28.03 | 55.85,9.37 55.4,8.91 55.4,7.72 55.4,7.67 55.45,7.62 | U1.1 65.21,11.55 C10.2
  Top 0.61: R30.2 55.44,9.1 v56.37,10.03 | v56.38,13.66 56.36,13.66 56.35,13.65 | 53.78,19.76 53.74,19.76 R2.2 53.74,19.76 53.77,19.79 54.88,19.79 v56.38,18.29 | v66.44,13.42 v66.45,13.41 66.45,11.13 C1.2 C10.2
  Top 0.813: R30.2 | U7.4 53.73,28.03 R2.2
  Bottom 0.254: 56.41,14.3 57.02,13.69 56.44,13.11 56.31,13.23 56.31,13.54 56.29,13.54 56.29,13.56 v56.38,13.66
  Bottom 0.61: v56.37,10.03 v56.37,13.65 v56.38,13.66 | v56.38,13.66 56.38,13.63 v56.38,13.66 | v66.44,13.42 66.16,13.7 56.39,13.7 56.38,13.7 v56.38,13.66 | v56.38,18.29 v56.38,13.66

### Text on the board
tPlace: Lin | Nin | U4 | Lout | Nout
bPlace: + | www.makerfabs.com | Lin | High Voltage! | - | Energy Meter for Home Assistant v1.1 | Nin | Lout | Nout
tNames: F1